# EAGLE schematic final_commit (EAGLE 9.3.2)
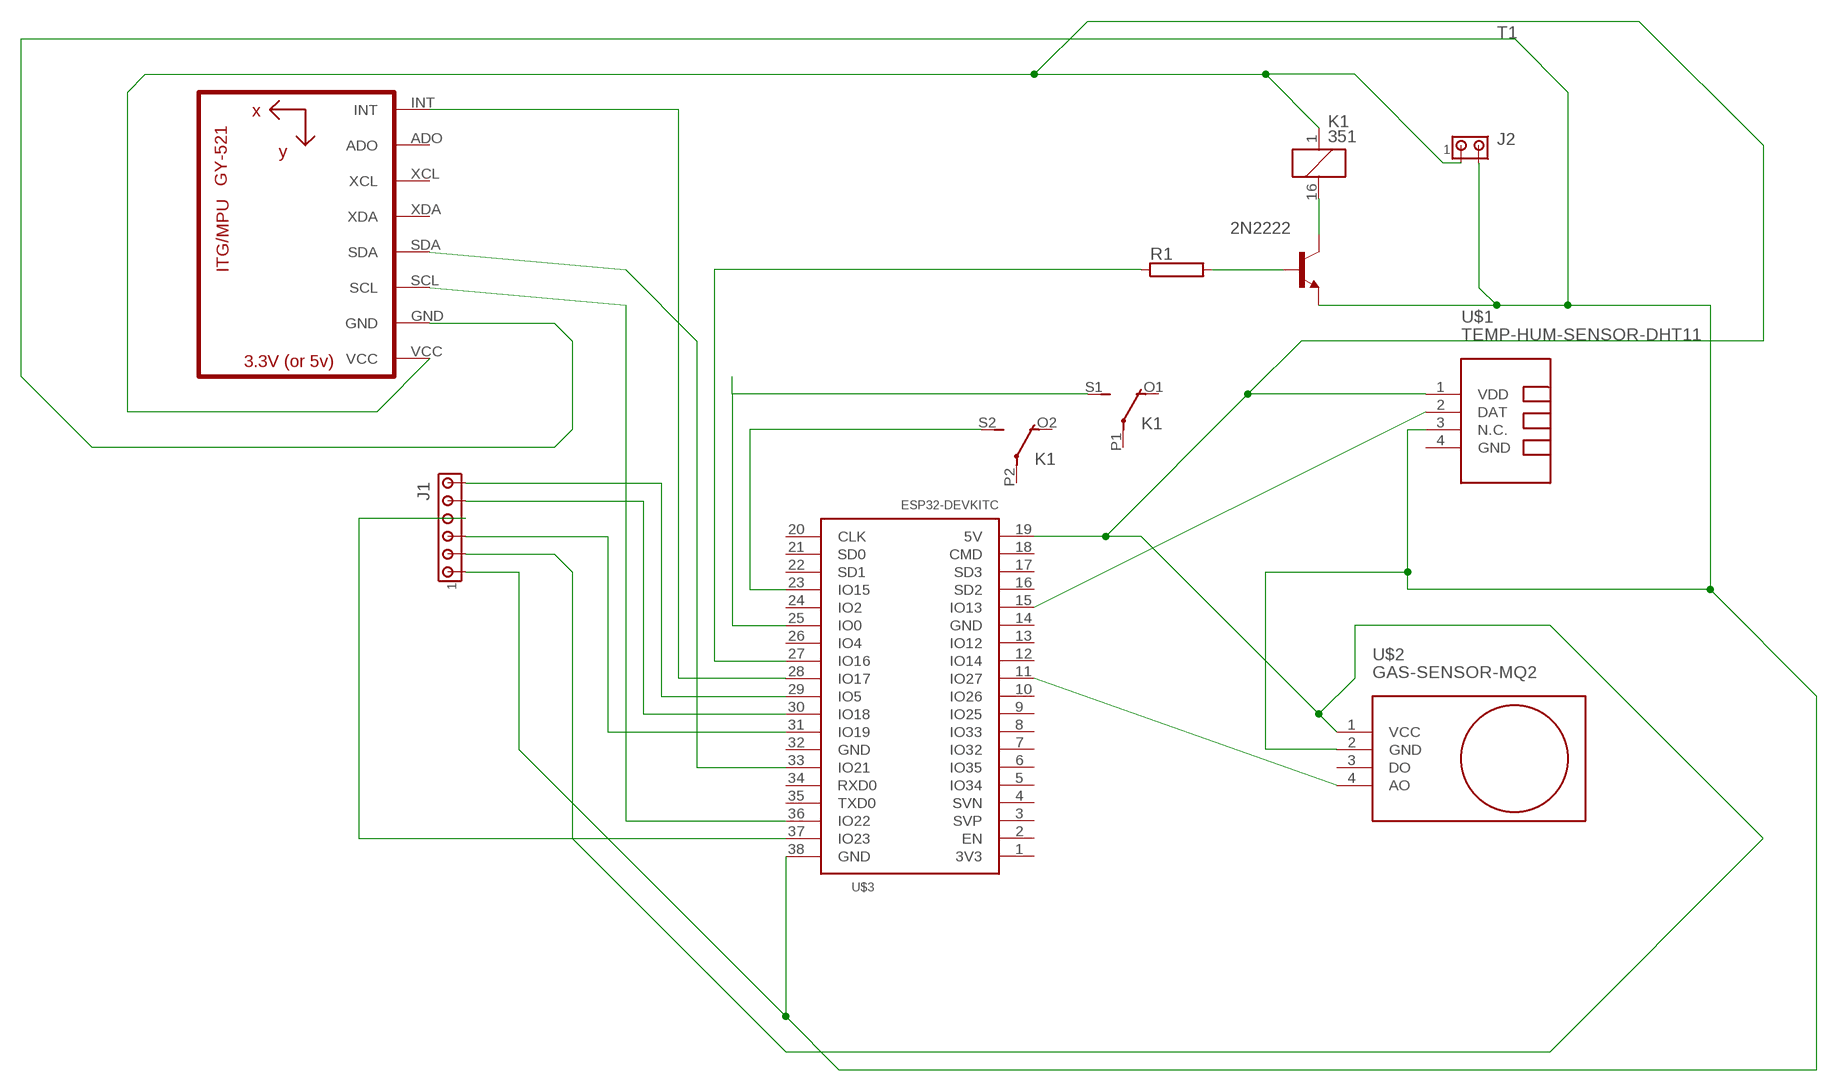
[diagram p0: schematic, sheet 1]

## Parts
J1  MTA06-100  [10X06MTA]
J2  MTA02-100  [10X02MTA]
K1  351  [351]
R1  RMG100-V  [TO-247-2V]
T1  2N2222  [TO18]
U2  GY-521MPU6050  [GY-521]
U$1  TEMP-HUM-SENSOR-DHT11  [TEMP-HUM-SENSOR-DHT11]
U$2  GAS-SENSOR-MQ2  [GAS-SENSOR-MQ2]
U$3  ESP32DEVKITC  [ESP32-DEVKITC]

## Nets
N$1: J1.6 U$3.29(IO5)
N$2: J1.5 U$3.30(IO18)
N$3: J1.4 U$3.37(IO23)
N$4: J1.3 U$3.31(IO19)
N$5: U2.INT U$3.28(IO17)
N$6: U2.SCL U$3.36(IO22)
N$7: U2.SDA U$3.33(IO21)
N$8: U$1.2(DAT) U$3.15(IO13)
N$9: U$2.4(AO) U$3.11(IO27)
N$10: R1.2 T1.2(B)
N$11: R1.1 U$3.27(IO16)
N$12: K1.16 T1.3(C)
N$13: K1.S1(2:S) U$3.25(IO0)
N$14: K1.S2(3:S) U$3.23(IO15)
N$15: J1.1 J2.2 T1.1(E) U2.GND U$1.3(N.C.) U$2.2(GND) U$3.38(GND)
N$17: J1.2 J2.1 K1.1 U2.VCC U$1.1(VDD) U$2.1(VCC) U$3.19(5V)
Unconnected: K1.O1(2:O) K1.O2(3:O) K1.P1(2:P) K1.P2(3:P) U2.ADO U2.XCL U2.XDA U$2.3(DO) U$3.1(3V3) U$3.2(EN) U$3.3(SVP) U$3.4(SVN) U$3.5(IO34) U$3.6(IO35) U$3.7(IO32) U$3.8(IO33) U$3.9(IO25) U$3.10(IO26) U$3.12(IO14) U$3.13(IO12) U$3.14(GND) U$3.16(SD2) U$3.17(SD3) U$3.18(CMD) U$3.20(CLK) U$3.21(SD0) U$3.22(SD1) U$3.24(IO2) U$3.26(IO4) U$3.32(GND) U$3.34(RXD0) U$3.35(TXD0)

## Power pins joined to a net without a drawn wire
GND: U$1.4(GND)

## Library data of the parts
J1 = con-amp:MTA06-100: AMP connector Connection corrected 2014-09-19
J2 = con-amp:MTA02-100: AMP connector
K1 = relay:351: RELAY 2 x switch, Omron; OC_FARNELL: unknown; OC_NEWARK: unknown
R1 = resistor-power:RMG100: TO-247 Power Resistor - RMG 100 Series Source: www.token.com.tw .. power-resistor-rmg100pdf; OC_FARNELL: unknown; OC_NEWARK: unknown
T1 = transistor:2N2222: NPN TRANSISTOR
U2 = gy-521:GY-521
U$1 = diy-modules:TEMP-HUM-SENSOR-DHT11: DHT11 - digital humidity & temperature sensor DHT11 datasheet available here: https://akizukidenshi.com/download/ds/aosong/DHT11.pdf Click here to find device on ebay.com <http://www.ebay.com/sch/dht11+digital+sensor>
U$2 = diy-modules:GAS-SENSOR-MQ2: Gas Sensor based on MQ-2 device Guide describing how to use MQ-2 sensor with Arduino is available here: http://www.instructables.com/id/How-to-use-MQ2-Gas-Sensor-Arduino-Tutorial/ MQ-2 sensor datasheet is available here: http://gas-sensor.ru/pdf/combustible-gas-sensor.pdf Click here to find device on ebay.com <http://www.ebay.com/sch/mq2+sensor+module+smoke>
U$3 = ESP32-DEVKITC:ESP32DEVKITC